# EAGLE design solenoid valve (EAGLE 9.2.2)

## Sheet 1 of 5: photorelay0
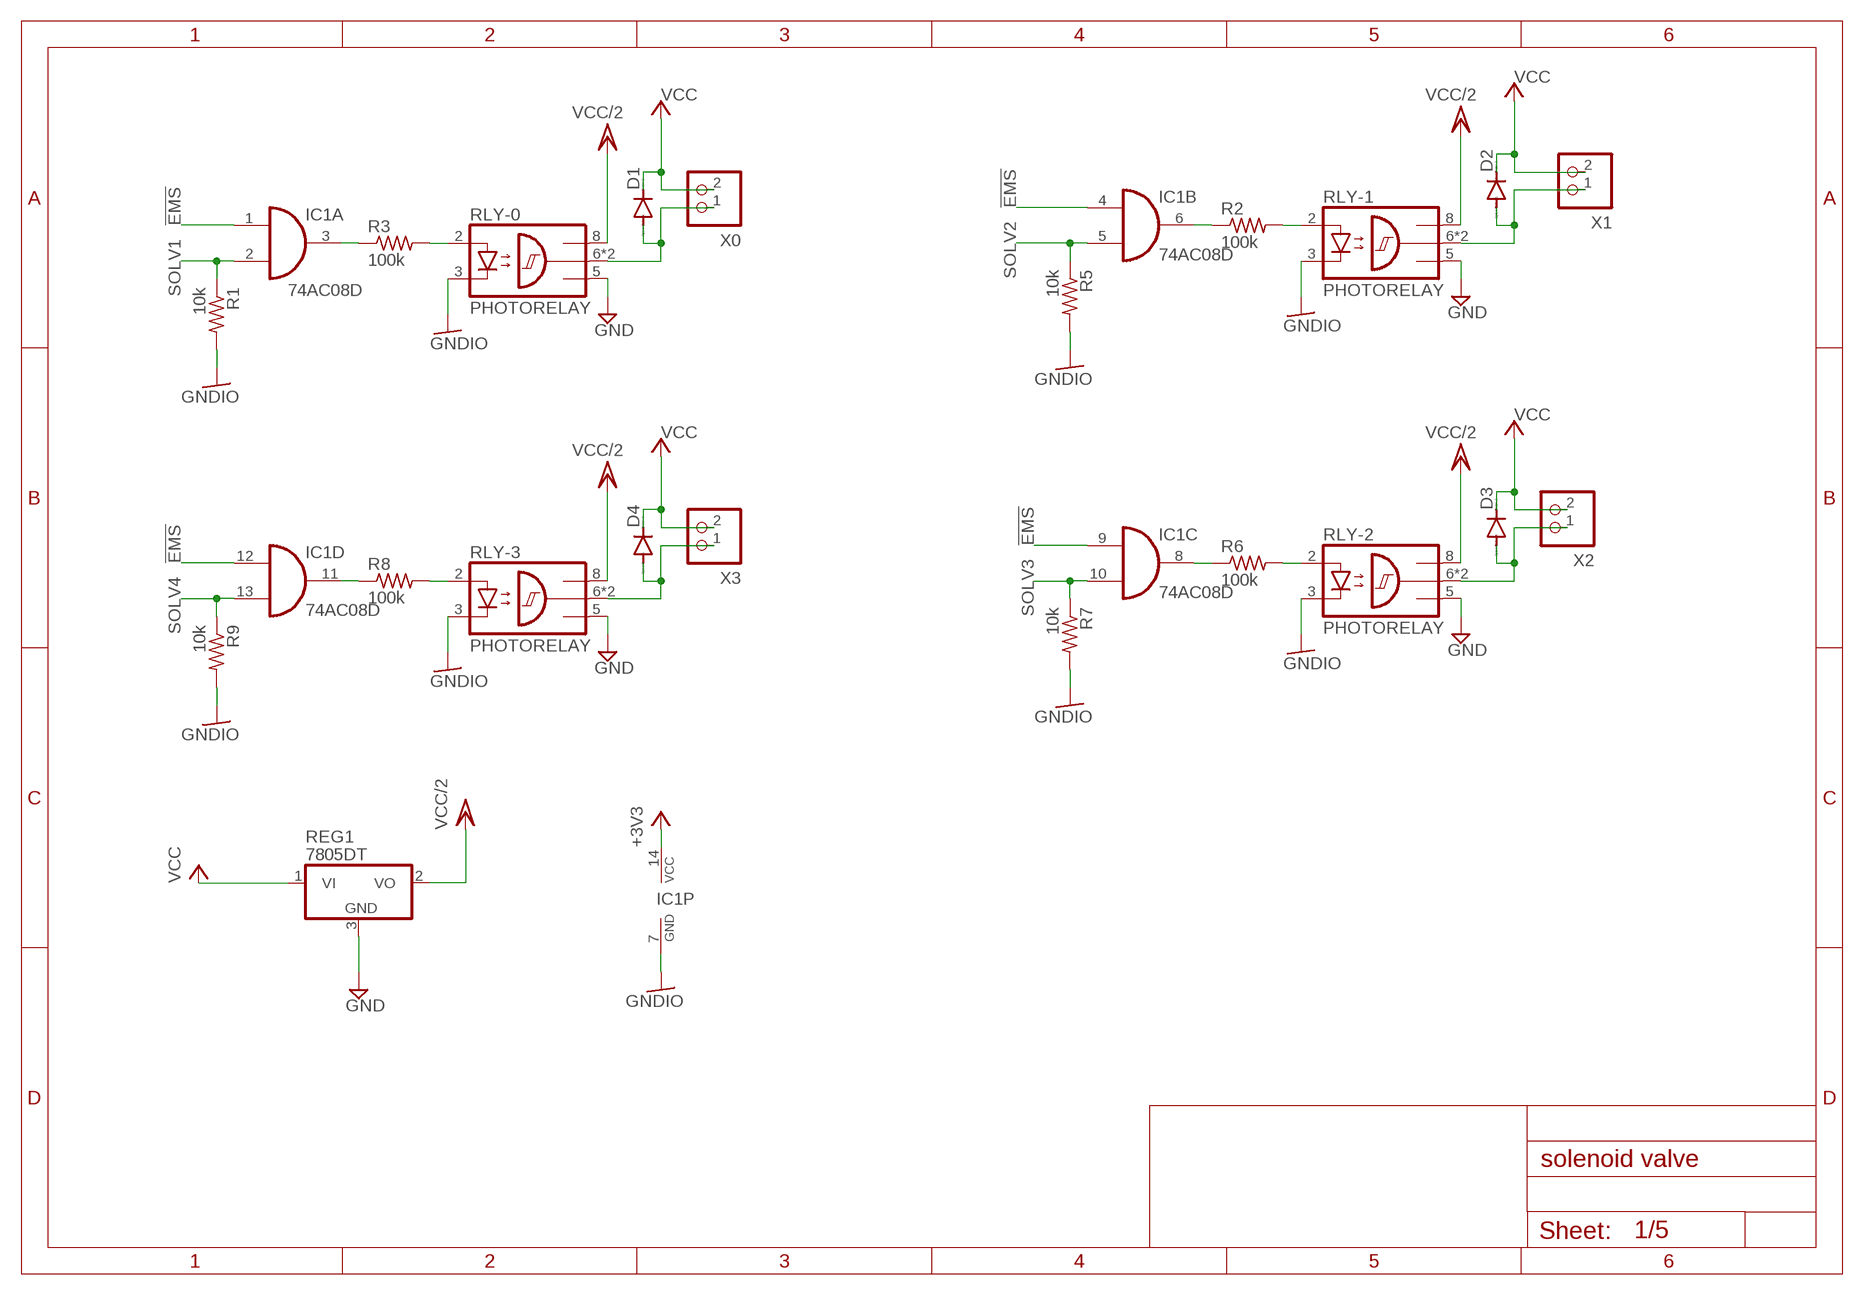
[diagram p0: schematic, sheet 1]

### Parts
D1  DIODE-SOD123  [SOD123]
D2  DIODE-SOD123  [SOD123]
D3  DIODE-SOD123  [SOD123]
D4  DIODE-SOD123  [SOD123]
IC1  74AC08D  [SO14]
R1  10k  R-US_R0603  [R0603]
R2  100k  R-US_R0603  [R0603]
R3  100k  R-US_R0603  [R0603]
R5  10k  R-US_R0603  [R0603]
R6  100k  R-US_R0603  [R0603]
R7  10k  R-US_R0603  [R0603]
R8  100k  R-US_R0603  [R0603]
R9  10k  R-US_R0603  [R0603]
REG1  7805DT  [TO252]
RLY-0  PHOTORELAY  [SOP254P1016X385-8]
RLY-1  PHOTORELAY  [SOP254P1016X385-8]
RLY-2  PHOTORELAY  [SOP254P1016X385-8]
RLY-3  PHOTORELAY  [SOP254P1016X385-8]
X0  S2B-XH-A  [S2B-XH-A]
X1  S2B-XH-A  [S2B-XH-A]
X2  S2B-XH-A  [S2B-XH-A]
X3  S2B-XH-A  [S2B-XH-A]

### Nets
!EMS: IC1.1(A:I0) IC1.4(B:I0) IC1.9(C:I0) IC1.12(D:I0) ; also sheet 2,3,4
+3V3: IC1.14(P:VCC) ; also sheet 2,3,5
GND: REG1.3(GND) RLY-0.5(GND) RLY-1.5(GND) RLY-2.5(GND) RLY-3.5(GND) ; also sheet 2
GNDIO: IC1.7(P:GND) R1.2 R5.2 R7.2 R9.2 RLY-0.3(C) RLY-1.3(C) RLY-2.3(C) RLY-3.3(C) ; also sheet 2,3,4,5
N$1: D2.A RLY-1.6(OUT) RLY-1.7(OUT) X1.1
N$2: R2.2 RLY-1.2(A)
N$3: D1.A RLY-0.6(OUT) RLY-0.7(OUT) X0.1
N$4: IC1.6(B:O) R2.1
N$5: D3.A RLY-2.6(OUT) RLY-2.7(OUT) X2.1
N$6: R3.2 RLY-0.2(A)
N$7: IC1.3(A:O) R3.1
N$8: R6.2 RLY-2.2(A)
N$20: IC1.8(C:O) R6.1
N$23: D4.A RLY-3.6(OUT) RLY-3.7(OUT) X3.1
N$24: R8.2 RLY-3.2(A)
N$25: IC1.11(D:O) R8.1
SOLV1: IC1.2(A:I1) R1.1 ; also sheet 3
SOLV2: IC1.5(B:I1) R5.1 ; also sheet 3
SOLV3: IC1.10(C:I1) R7.1 ; also sheet 3
SOLV4: IC1.13(D:I1) R9.1 ; also sheet 3
VCC: D1.C D2.C D3.C D4.C REG1.1(VI) X0.2 X1.2 X2.2 X3.2 ; also sheet 2
VCC/2: REG1.2(VO) RLY-0.8(VCC) RLY-1.8(VCC) RLY-2.8(VCC) RLY-3.8(VCC) ; also sheet 2

## Sheet 2 of 5: photorelay1
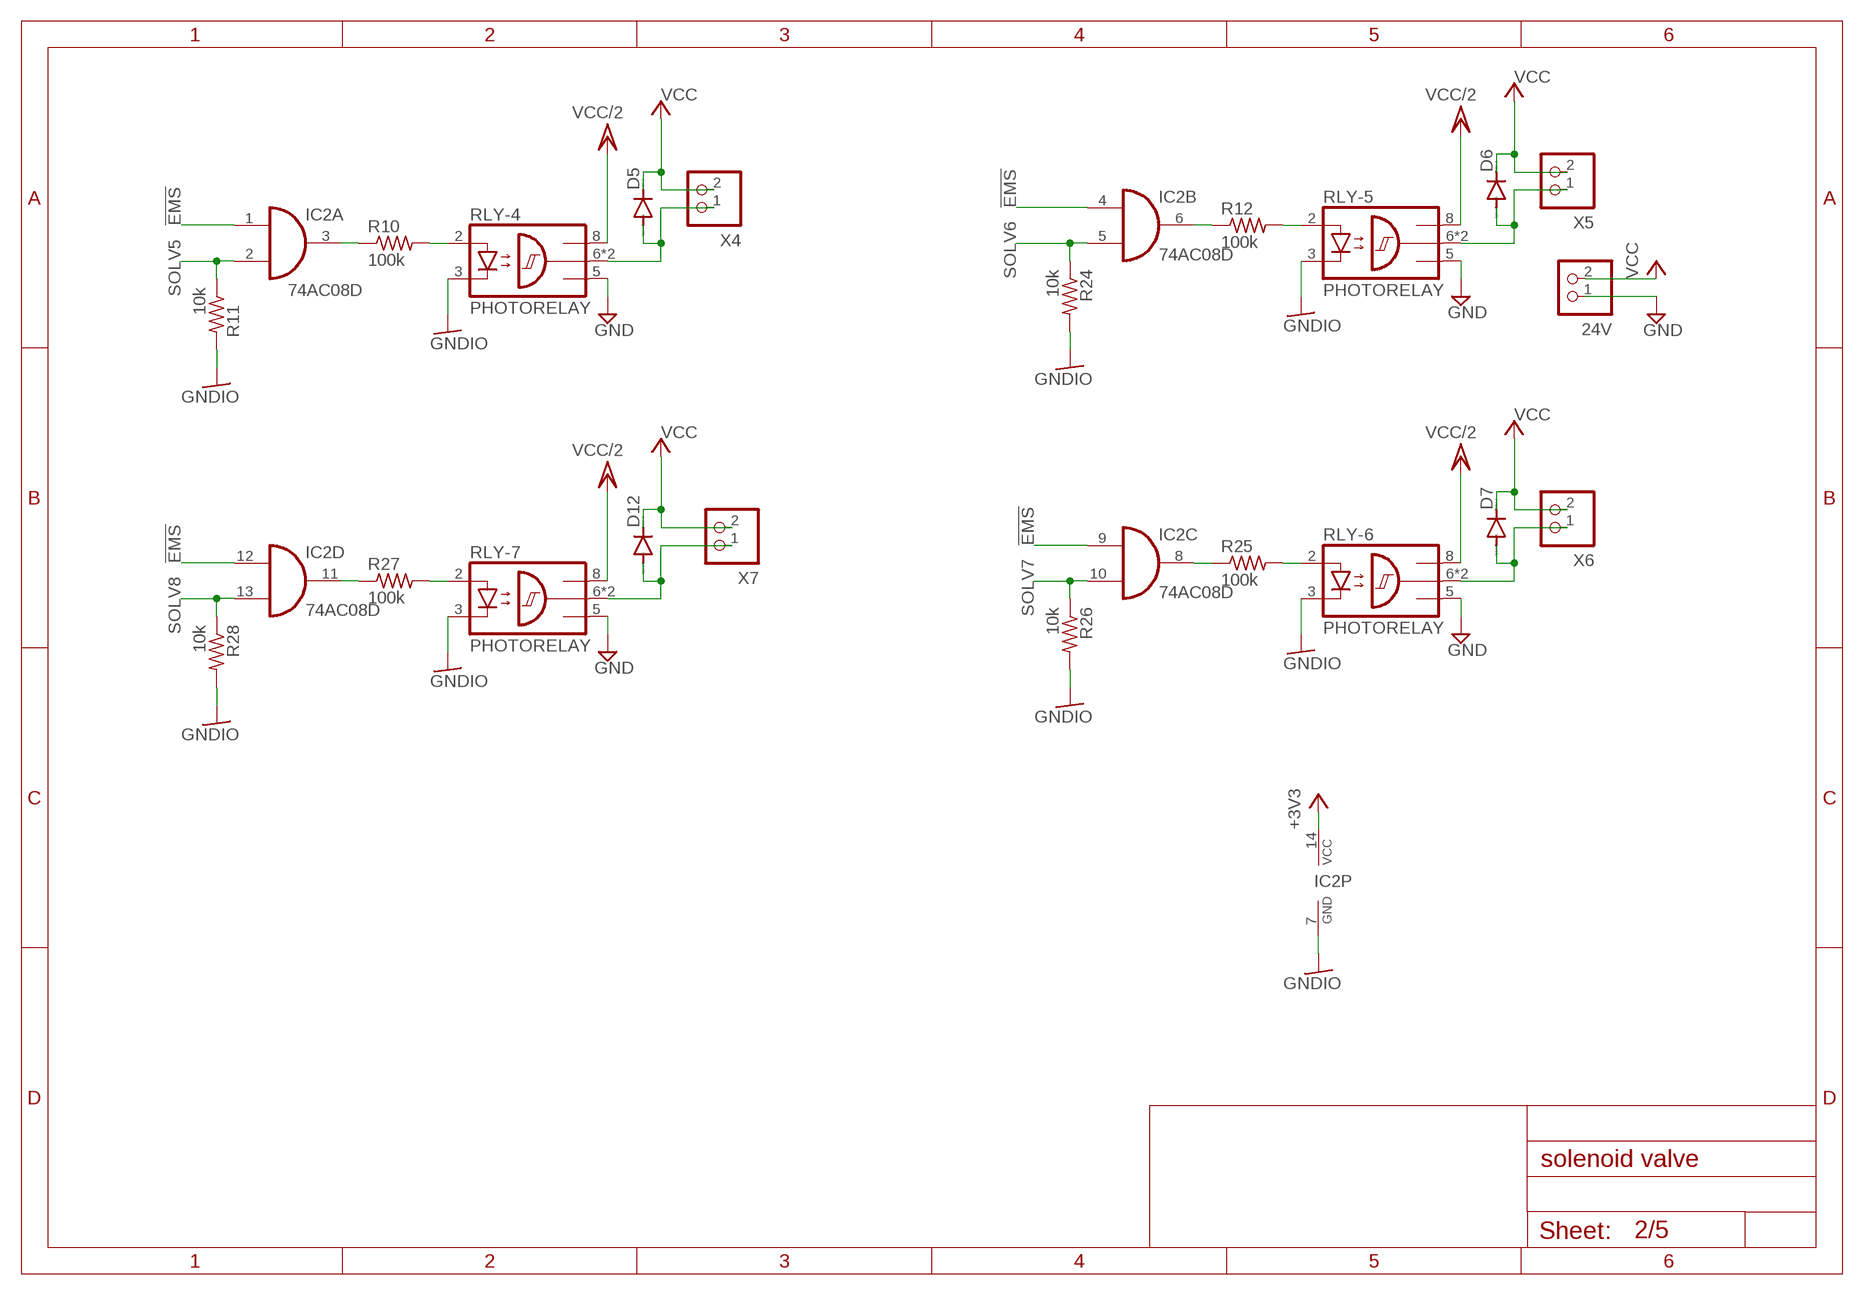
[diagram p1: schematic, sheet 2]

### Parts
24V  S2B-XH-A  [S2B-XH-A]
D5  DIODE-SOD123  [SOD123]
D6  DIODE-SOD123  [SOD123]
D7  DIODE-SOD123  [SOD123]
D12  DIODE-SOD123  [SOD123]
IC2  74AC08D  [SO14]
R10  100k  R-US_R0603  [R0603]
R11  10k  R-US_R0603  [R0603]
R12  100k  R-US_R0603  [R0603]
R24  10k  R-US_R0603  [R0603]
R25  100k  R-US_R0603  [R0603]
R26  10k  R-US_R0603  [R0603]
R27  100k  R-US_R0603  [R0603]
R28  10k  R-US_R0603  [R0603]
RLY-4  PHOTORELAY  [SOP254P1016X385-8]
RLY-5  PHOTORELAY  [SOP254P1016X385-8]
RLY-6  PHOTORELAY  [SOP254P1016X385-8]
RLY-7  PHOTORELAY  [SOP254P1016X385-8]
X4  S2B-XH-A  [S2B-XH-A]
X5  S2B-XH-A  [S2B-XH-A]
X6  S2B-XH-A  [S2B-XH-A]
X7  S2B-XH-A  [S2B-XH-A]

### Nets
!EMS: IC2.1(A:I0) IC2.4(B:I0) IC2.9(C:I0) IC2.12(D:I0) ; also sheet 1,3,4
+3V3: IC2.14(P:VCC) ; also sheet 1,3,5
GND: 24V.1 RLY-4.5(GND) RLY-5.5(GND) RLY-6.5(GND) RLY-7.5(GND) ; also sheet 1
GNDIO: IC2.7(P:GND) R11.2 R24.2 R26.2 R28.2 RLY-4.3(C) RLY-5.3(C) RLY-6.3(C) RLY-7.3(C) ; also sheet 1,3,4,5
N$26: D5.A RLY-4.6(OUT) RLY-4.7(OUT) X4.1
N$27: R10.2 RLY-4.2(A)
N$28: IC2.3(A:O) R10.1
N$29: D6.A RLY-5.6(OUT) RLY-5.7(OUT) X5.1
N$30: R12.2 RLY-5.2(A)
N$31: IC2.6(B:O) R12.1
N$32: D7.A RLY-6.6(OUT) RLY-6.7(OUT) X6.1
N$33: R25.2 RLY-6.2(A)
N$34: IC2.8(C:O) R25.1
N$35: D12.A RLY-7.6(OUT) RLY-7.7(OUT) X7.1
N$36: R27.2 RLY-7.2(A)
N$37: IC2.11(D:O) R27.1
SOLV5: IC2.2(A:I1) R11.1 ; also sheet 3
SOLV6: IC2.5(B:I1) R24.1 ; also sheet 3
SOLV7: IC2.10(C:I1) R26.1 ; also sheet 3
SOLV8: IC2.13(D:I1) R28.1 ; also sheet 3
VCC: 24V.2 D5.C D6.C D7.C D12.C X4.2 X5.2 X6.2 X7.2 ; also sheet 1
VCC/2: RLY-4.8(VCC) RLY-5.8(VCC) RLY-6.8(VCC) RLY-7.8(VCC) ; also sheet 1

## Sheet 3 of 5: mcu
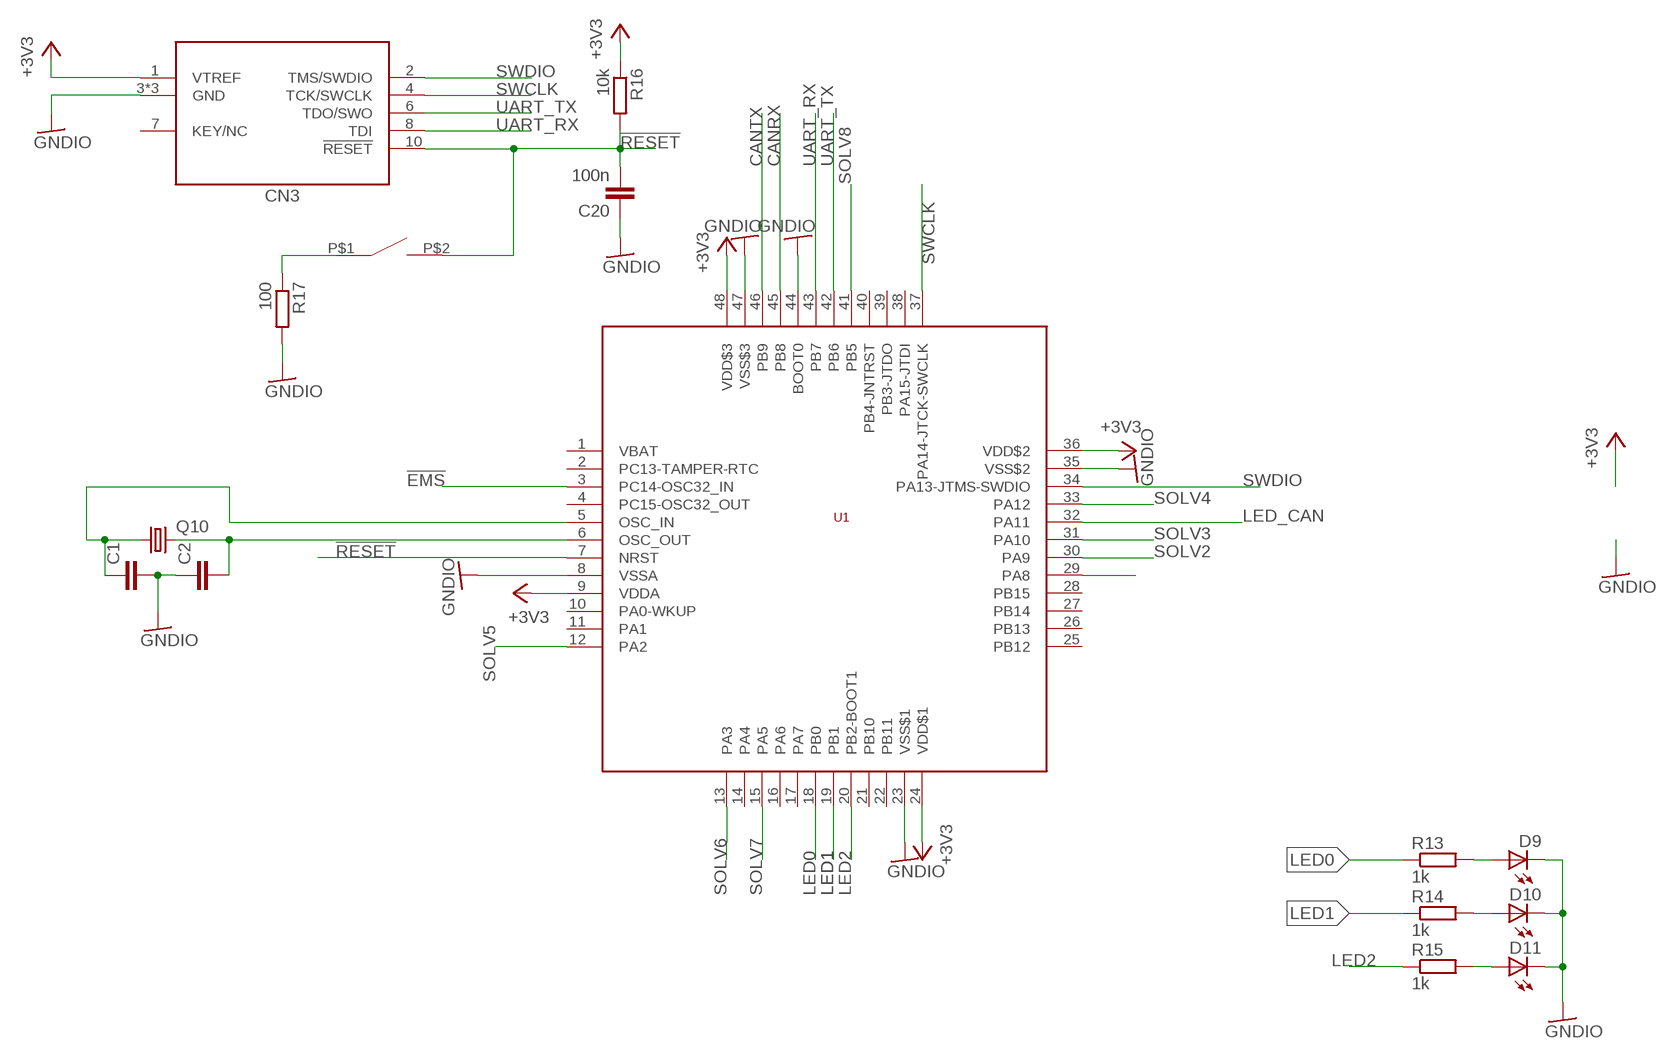
[diagram p2: schematic, sheet 3]

### Parts
C1  C-EUC0603  [C0603]
C2  C-EUC0603  [C0603]
C20  100n  C-EUC0603  [C0603]
CN3  CON_SWD_1.27_SMD  [CON_SWD_1.27_SMD]
D9  LEDCHIPLED_0805  [CHIPLED_0805]
D10  LEDCHIPLED_0805  [CHIPLED_0805]
D11  LEDCHIPLED_0805  [CHIPLED_0805]
Q10  CRYSTALHC49UP  [HC49UP]
R13  1k  R-EU_R0603  [R0603]
R14  1k  R-EU_R0603  [R0603]
R15  1k  R-EU_R0603  [R0603]
R16  10k  R-EU_R0603  [R0603]
R17  100  R-EU_R0603  [R0603]
SW1  SWITCH_TACTILETOP  [SWITCH_TACTILE_3X6]
U1  STM32F103C8  [LQFP48]

### Nets
!EMS: U1.3(PC14-OSC32_IN) ; also sheet 1,2,4
!RESET: C20.2 CN3.10(!RESET) R16.2 SW1.P$2 U1.7(NRST)
+3V3: CN3.1(VTREF) R16.1 U1.9(VDDA) U1.24(VDD$1) U1.36(VDD$2) U1.48(VDD$3) ; also sheet 1,2,5
CANRX: U1.45(PB8) ; also sheet 4
CANTX: U1.46(PB9) ; also sheet 4
GNDIO: C1.2 C2.1 C20.1 CN3.3(GND) CN3.5(GND) CN3.9(GND) D9.C D10.C D11.C R17.2 U1.8(VSSA) U1.23(VSS$1) U1.35(VSS$2) U1.44(BOOT0) U1.47(VSS$3) ; also sheet 1,2,4,5
LED0: R13.1 U1.18(PB0)
LED1: R14.1 U1.19(PB1)
LED2: R15.1 U1.20(PB2-BOOT1)
LED_CAN: U1.32(PA11) ; also sheet 4
N$9: D10.A R14.2
N$10: D9.A R13.2
N$11: C2.2 Q10.2 U1.6(OSC_OUT)
N$16: R17.1 SW1.P$1
N$19: C1.1 Q10.1 U1.5(OSC_IN)
N$21: D11.A R15.2
SOLV1: U1.29(PA8) ; also sheet 1
SOLV2: U1.30(PA9) ; also sheet 1
SOLV3: U1.31(PA10) ; also sheet 1
SOLV4: U1.33(PA12) ; also sheet 1
SOLV5: U1.12(PA2) ; also sheet 2
SOLV6: U1.13(PA3) ; also sheet 2
SOLV7: U1.15(PA5) ; also sheet 2
SOLV8: U1.41(PB5) ; also sheet 2
SWCLK: CN3.4(TCK/SWCLK) U1.37(PA14-JTCK-SWCLK)
SWDIO: CN3.2(TMS/SWDIO) U1.34(PA13-JTMS-SWDIO)
UART_RX: CN3.8(TDI) U1.43(PB7)
UART_TX: CN3.6(TDO/SWO) U1.42(PB6)
Unconnected: CN3.7(KEY/NC) U1.1(VBAT) U1.2(PC13-TAMPER-RTC) U1.4(PC15-OSC32_OUT) U1.10(PA0-WKUP) U1.11(PA1) U1.14(PA4) U1.16(PA6) U1.17(PA7) U1.21(PB10) U1.22(PB11) U1.25(PB12) U1.26(PB13) U1.27(PB14) U1.28(PB15) U1.38(PA15-JTDI) U1.39(PB3-JTDO) U1.40(PB4-JNTRST)

## Sheet 4 of 5: can
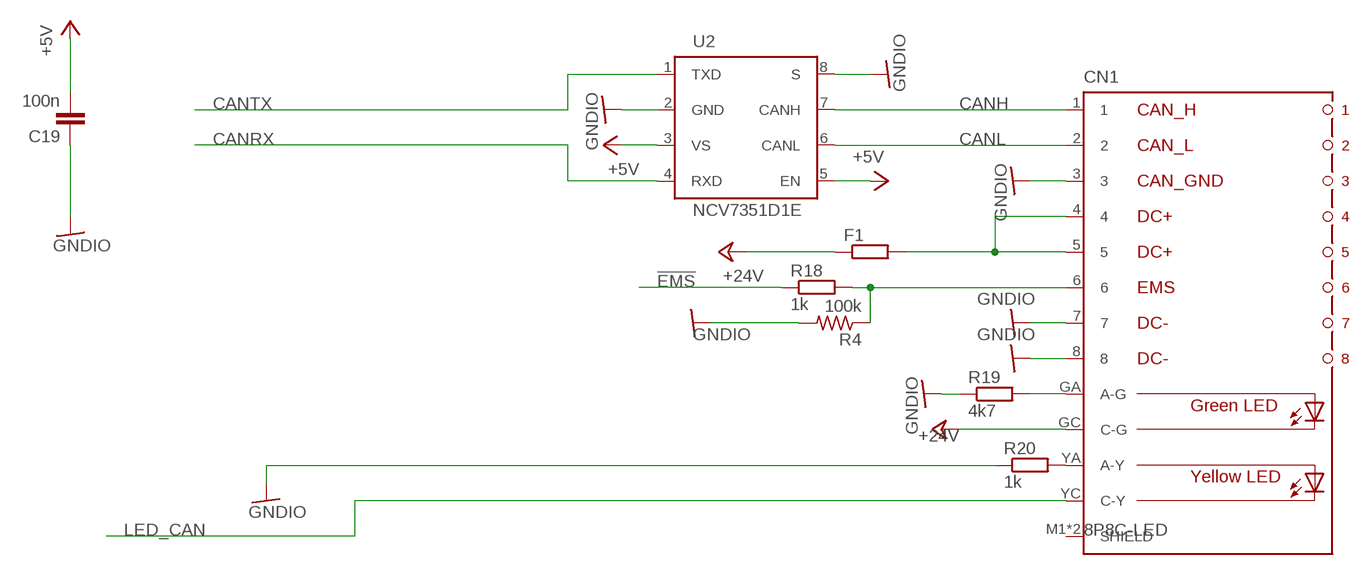
[diagram p3: schematic, sheet 4]

### Parts
C19  100n  C-EUC0603  [C0603]
CN1  8P8C-LED  [8P8C-LED]
F1  R-EU_R1206  [R1206]
R4  100k  R-US_R0603  [R0603]
R18  1k  R-EU_R0603  [R0603]
R19  4k7  R-EU_R0603  [R0603]
R20  1k  R-EU_R0603  [R0603]
U2  NCV7351D1E  [SO08]

### Nets
!EMS: R18.1 ; also sheet 1,2,3
+5V: C19.2 U2.3(VS) U2.5(EN) ; also sheet 5
+24V: CN1.GC(C-G) F1.1 ; also sheet 5
CANH: CN1.1 U2.7(CANH)
CANL: CN1.2 U2.6(CANL)
CANRX: U2.4(RXD) ; also sheet 3
CANTX: U2.1(TXD) ; also sheet 3
GNDIO: C19.1 CN1.3 CN1.7 CN1.8 R4.2 R19.1 R20.1 U2.2(GND) U2.8(S) ; also sheet 1,2,3,5
LED_CAN: CN1.YC(C-Y) ; also sheet 3
N$12: CN1.4 CN1.5 F1.2
N$18: CN1.YA(A-Y) R20.2
N$22: CN1.GA(A-G) R19.2
N$38: CN1.6 R4.1 R18.2
Unconnected: CN1.M1(SHIELD) CN1.M2(SHIELD)

## Sheet 5 of 5: power suply
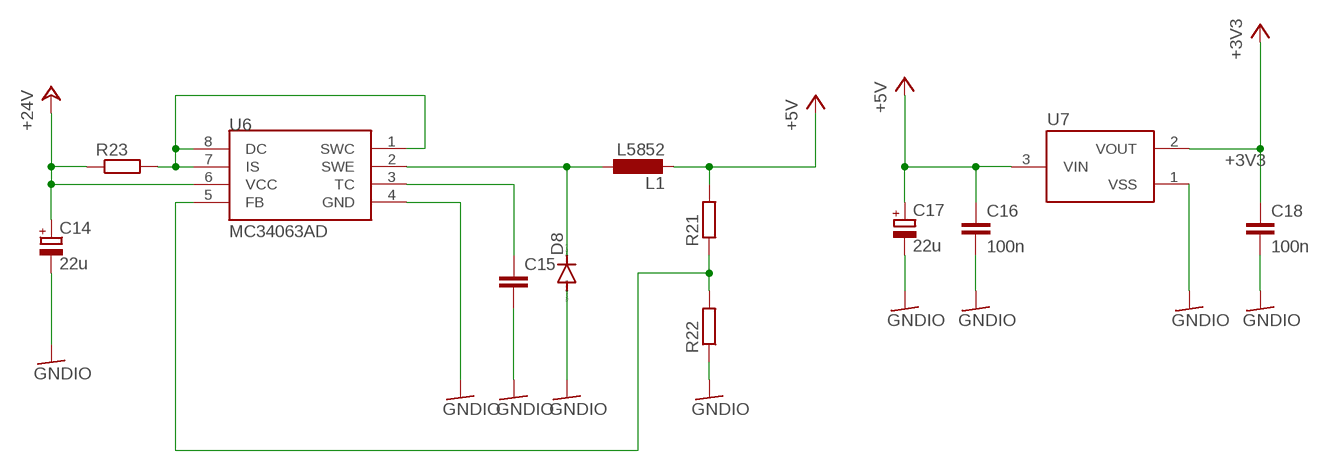
[diagram p4: schematic, sheet 5]

### Parts
C14  22u  CPOL-EUE2-5  [E2-5]
C15  C-EUC0603  [C0603]
C16  100n  C-EUC0603  [C0603]
C17  22u  CPOL-EUE2-5  [E2-5]
C18  100n  C-EUC0603  [C0603]
D8  DIODE-SOD123  [SOD123]
L1  L5852  [L5852]
R21  R-EU_R0603  [R0603]
R22  R-EU_R0603  [R0603]
R23  R-EU_R1206  [R1206]
U6  MC34063AD  [SOIC8]
U7  XC6206  [SOT95P240X110-3]

### Nets
+3V3: C18.1 U7.2(VOUT) ; also sheet 1,2,3
+5V: C16.1 C17.+ L1.P$2 R21.2 U7.3(VIN) ; also sheet 4
+24V: C14.+ R23.1 U6.6(VCC) ; also sheet 4
GNDIO: C14.- C15.2 C16.2 C17.- C18.2 D8.A R22.1 U6.4(GND) U7.1(VSS) ; also sheet 1,2,3,4
N$13: R23.2 U6.1(SWC) U6.7(IS) U6.8(DC)
N$14: D8.C L1.P$1 U6.2(SWE)
N$15: C15.1 U6.3(TC)
N$17: R21.1 R22.2 U6.5(FB)

## Library data of the parts
24V X0 X1-X7 = jst-xh:S2B-XH-A: Wire-to-Board 2.5mm pitch side mount connector Source: http://www.jst-mfg.com/product/pdf/jpn/XH.pdf http://www.jst-mfg.com/product/detail.php?series=277
C1 C2 C15 = rcl:C-EU: CAPACITOR, European symbol; SPICEPREFIX: C
C14 C17 = rcl:CPOL-EU: POLARIZED CAPACITOR, European symbol
C16 C18-C20 = rcl:C-EU: CAPACITOR, European symbol
CN1 = con-rj45:8P8C-LED: generic 8P8C connector with two LED's; OC_FARNELL: unknown; OC_NEWARK: unknown
CN3 = con-swd:CON_SWD_1.27_SMD
D1-D8 D12 = diode:DIODE-: DIODE
D9-D11 = led:LED: LED OSRAM: - CHIPLED LG R971, LG N971, LY N971, LG Q971, LY Q971, LO R971, LY R971 LH N974, LH R974 LS Q976, LO Q976, LY Q976 LO Q996 - Hyper CHIPLED LW Q18S LB Q993, LB Q99A, LB R99A - SideLED LS A670, LO A670, LY A670, LG A670, LP A670 LB A673, LV A673, LT A673, LW A673 LH A674 LY A675 LS A676, LA A676, LO A676, LY A676, LW A676 LS A679, LY A679, LG A679 - Hyper Micro SIDELED® LS Y876, LA Y876, LO Y876, LY Y876 LT Y87S - SmartLED LW L88C, LW L88S LB L89C, LB L89S, LG L890 LS L89K, LO L89K, LY L89K LS L896, LA L896, LO L896, LY L896 - TOPLED LS T670, LO T670, LY T670, LG T670, LP T670 LSG T670, LSP T670, LSY T670, LOP T670, LYG T670 LG T671, LOG T671, LSG T671 LB T673, LV T673, LT T673, LW T673 LH T674 LS T676, LA T676, LO T676, LY T676, LB T676, LH T676, LSB T676, LW T676 LB T67C, LV T67C, LT T67C, LS T67K, LO T67K, LY T67K, LW E67C LS E67B, LA E67B, LO E67B, LY E67B, LB E67C, LV E67C, LT E67C LW T67C LS T679, LY T679, LG T679 LS T770, LO T770, LY T770, LG T770, LP T770 LB T773, LV T773, LT T773, LW T773 LH T774 LS E675, LA E675, LY E675, LS T675 LS T776, LA T776, LO T776, LY T776, LB T776 LHGB T686 LT T68C, LB T68C - Hyper Mini TOPLED® LB M676 - Mini TOPLED Santana® LG M470 LS M47K, LO M47K, LY M47K Source: http://www.osram.convergy.de LUXEON: - LUMILED® LXK2-PW12-R00, LXK2-PW12-S00, LXK2-PW14-U00, LXK2-PW14-V00 LXK2-PM12-R00, LXK2-PM12-S00, LXK2-PM14-U00 LXK2-PE12-Q00, LXK2-PE12-R00, LXK2-PE12-S00, LXK2-PE14-T00, LXK2-PE14-U00 LXK2-PB12-K00, LXK2-PB12-L00, LXK2-PB12-M00, LXK2-PB14-N00, LXK2-PB14-P00, LXK2-PB14-Q00 LXK2-PR12-L00, LXK2-PR12-M00, LXK2-PR14-Q00, LXK2-PR14-R00 LXK2-PD12-Q00, LXK2-PD12-R00, LXK2-PD12-S00 LXK2-PH12-R00, LXK2-PH12-S00 LXK2-PL12-P00, LXK2-PL12-Q00, LXK2-PL12-R00 Source: www.luxeon.com KINGBRIGHT: KA-3528ASYC Source: www.kingbright.com
F1 R18-R23 = rcl:R-EU_: RESISTOR, European symbol; SPICEPREFIX: R
IC1 IC2 = 74xx-eu:74*08: Quad 2-input AND gate
L1 = l_ysk:L5852
Q10 = crystal:CRYSTAL: CRYSTAL; OC_FARNELL: unknown; OC_NEWARK: unknown
R1-R12 R24-R28 = rcl:R-US_: RESISTOR, American symbol; SPICEPREFIX: R
R13-R17 = rcl:R-EU_: RESISTOR, European symbol
REG1 = linear:78*: Positive VOLTAGE REGULATOR Source: http://cache.national.com/ds/LM/LM78L05.pdf http://www.fairchildsemi.com/ds/LM/LM7805.pdf
RLY-0 RLY-1-RLY-7 = opto-coupler:PHOTORELAY
SW1 = switch-tactile:SWITCH_TACTILE
U1 = stm32_mcu:STM32F103C8: STMicroelectronics STM32F103C8 Mainstream Performance line, ARM Cortex-M3 MCU with 64 Kbytes Flash, 72 MHz CPU, motor control, USB and CAN references: datasheet <https://www.st.com/resource/en/datasheet/stm32f103c8.pdf> product page <https://www.st.com/ja/microcontrollers/stm32f103c8.html>
U2 = on-semi:NCV7351D1E: High Speed CAN Transceiver Source: NCV7351-D.PDF <http://www.onsemi.com/PowerSolutions/document/NCV7351-D.PDF>
U6 = mc34063:MC34063
U7 = torex:XC6206

## Board
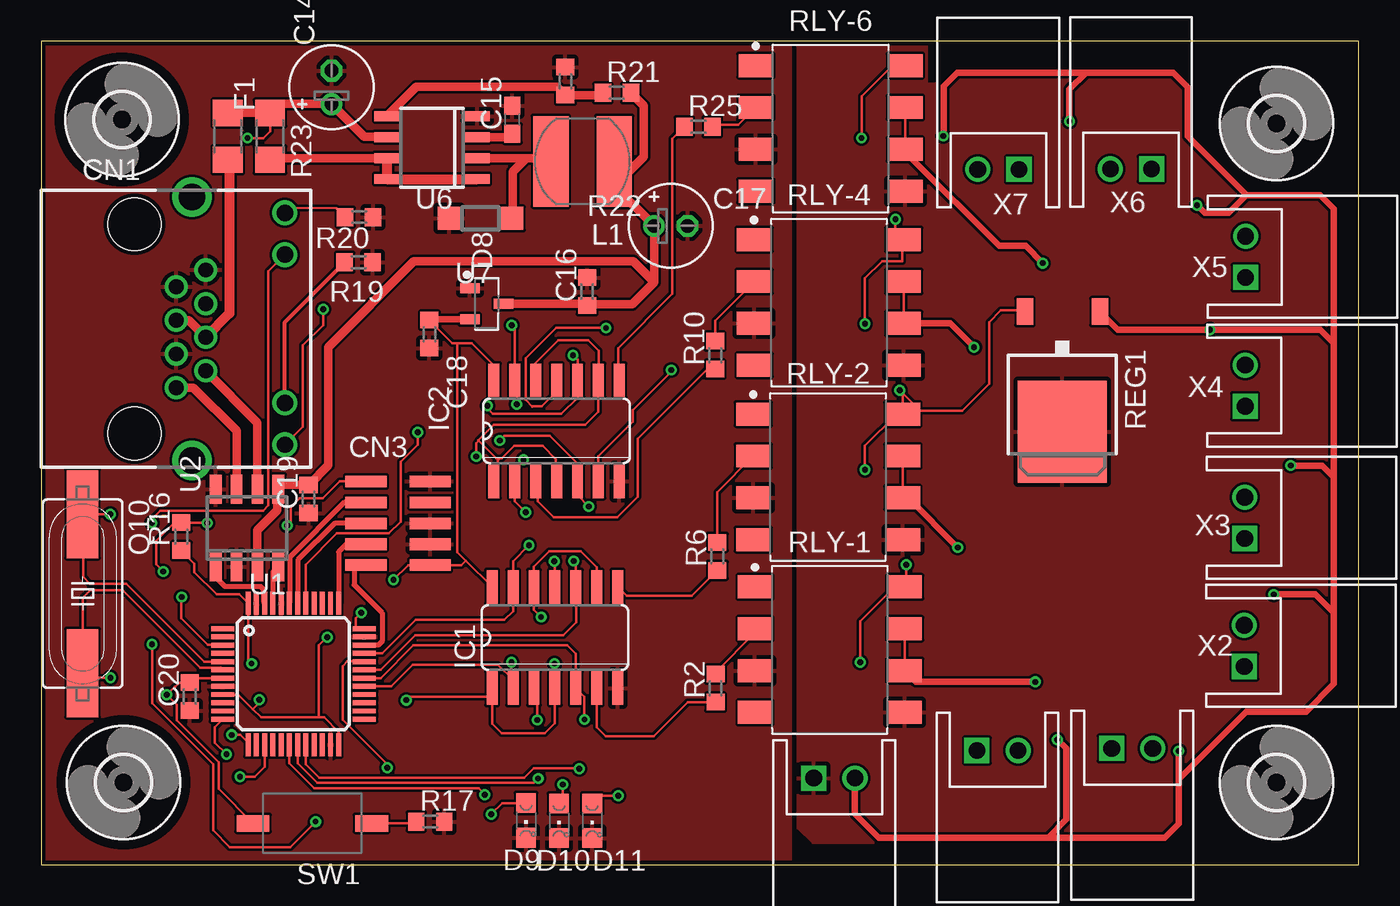
[diagram p5: board, top side]
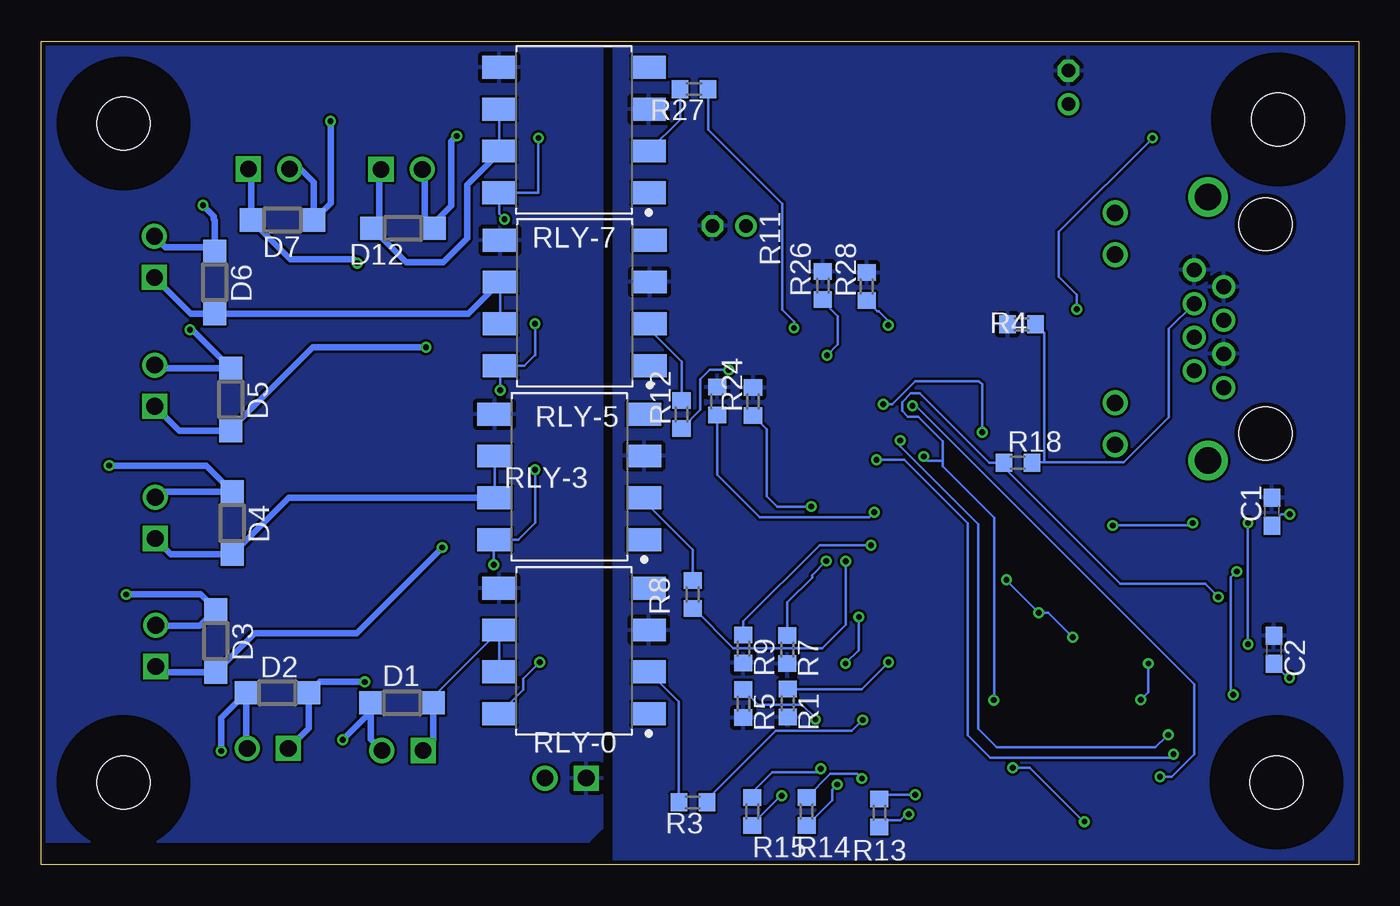
[diagram p6: board, bottom side, seen from below]

Size 80 x 50 mm. Coordinates in mm from the lower left corner, seen from the top.
Outline: 0,0 80,0 80,50 0,50 0,0
Copper layers (1*16): Top 0.035mm / dielectric 1.5mm / Bottom 0.035mm
Design rules "SeeedStudio_2layer_DRU_no_angle_20140221": minimum track width 6mil, minimum drill 12mil, track to track 6mil, track to pad 6mil, pad to pad 6mil, via to via 6mil, smd to smd 0mil, copper to edge 10mil, drill to drill 10mil, minimum pad ring 10mil, minimum via ring 6mil, stop-mask expansion 2mil, vias tented up to drill 100mil, thermal gap 10mil

### Footprints (pad centres in the part's own frame; a part is rotated, then mirrored left to right if it is on the bottom)
S2B-XH-A = drill 1.016 square: 1 1.25,0 | drill 1.016: 2 -1.25,0
C0603 = smd 1.1 x 1: 1 -0.85,0; 2 0.85,0
E2-5 = drill 0.813 pad 1.27: + -1.016,0 | drill 0.813 pad 1.27 octagon: - 1.016,0
C0603' = smd 1 x 1.1: 1 -0.85,0; 2 0.85,0
8P8C-LED = drill 0.9 pad 1.3: 1 3.57,-3.81; 2 2.55,-2.03; 3 1.53,-3.81; 4 0.51,-2.03; 5 -0.51,-3.81; 6 -1.53,-2.03; 7 -2.55,-3.81; 8 -3.57,-2.03 | drill 1 pad 1.422: GA 4.5,2.78; GC 7.04,2.78; YA -7.04,2.78; YC -4.5,2.78 | drill 1.6 pad 2.184: M1 -8,-2.85; M2 8,-2.85 | hole 3.2: 6.35,-6.35; -6.35,-6.35
CON_SWD_1.27_SMD = smd 0.7 x 2.5: 1 2.54,1.95; 2 2.54,-1.95; 3 1.27,1.95; 4 1.27,-1.95; 5 0,1.95; 6 0,-1.95; 7 -1.27,1.95; 8 -1.27,-1.95; 9 -2.54,1.95; 10 -2.54,-1.95
SOD123 = smd 1.4 x 1.4: A 1.9,0; C -1.9,0
CHIPLED_0805 = smd 1.2 x 1.2: A 0,-1.05; C 0,1.05
R1206 = smd 1.6 x 1.803: 1 -1.422,0; 2 1.422,0
SO14 = smd 0.66 x 2.032: 1 -3.81,-3.073; 2 -2.54,-3.073; 3 -1.27,-3.073; 4 0,-3.073; 5 1.27,-3.073; 6 2.54,-3.073; 7 3.81,-3.073; 8 3.81,3.073; 9 2.54,3.073; 10 1.27,3.073; 11 0,3.073; 12 -1.27,3.073; 13 -2.54,3.073; 14 -3.81,3.073
L5852 = smd 2.15 x 5.5: P$1 1.925,0; P$2 -1.925,0
HC49UP = smd 5.334 x 1.93: 1 -4.826,0; 2 4.826,0
R0603 = smd 1 x 1.1: 1 -0.85,0; 2 0.85,0
TO252 = smd 1 x 1.6: 1 -2.28,-4.8; 2 2.28,-4.8 | smd 5.4 x 6.2: 3 0,2.5
SOP254P1016X385-8 = smd 2.09 x 1.389: 1 -4.54,3.81; 2 -4.54,1.27; 3 -4.54,-1.27; 4 -4.54,-3.81; 5 4.54,-3.81; 6 4.54,-1.27; 7 4.54,1.27; 8 4.54,3.81
SWITCH_TACTILE_3X6 = smd 2 x 1: P$1 -3.6,0; P$2 3.6,0
LQFP48 = smd 1.4 x 0.3: 1 -4.3,2.75; 2 -4.3,2.25; 3 -4.3,1.75; 4 -4.3,1.25; 5 -4.3,0.75; 6 -4.3,0.25; 7 -4.3,-0.25; 8 -4.3,-0.75; 9 -4.3,-1.25; 10 -4.3,-1.75; 11 -4.3,-2.25; 12 -4.3,-2.75; 25 4.3,-2.75; 26 4.3,-2.25; 27 4.3,-1.75; 28 4.3,-1.25; 29 4.3,-0.75; 30 4.3,-0.25; 31 4.3,0.25; 32 4.3,0.75; 33 4.3,1.25; 34 4.3,1.75; 35 4.3,2.25; 36 4.3,2.75 | smd 0.3 x 1.4: 13 -2.75,-4.3; 14 -2.25,-4.3; 15 -1.75,-4.3; 16 -1.25,-4.3; 17 -0.75,-4.3; 18 -0.25,-4.3; 19 0.25,-4.3; 20 0.75,-4.3; 21 1.25,-4.3; 22 1.75,-4.3; 23 2.25,-4.3; 24 2.75,-4.3; 37 2.75,4.3; 38 2.25,4.3; 39 1.75,4.3; 40 1.25,4.3; 41 0.75,4.3; 42 0.25,4.3; 43 -0.25,4.3; 44 -0.75,4.3; 45 -1.25,4.3; 46 -1.75,4.3; 47 -2.25,4.3; 48 -2.75,4.3
SO08 = smd 0.72 x 1.78: 1 -1.905,-2.35; 2 -0.635,-2.35; 3 0.635,-2.35; 4 1.905,-2.35; 5 1.905,2.35; 6 0.635,2.35; 7 -0.635,2.35; 8 -1.905,2.35
SOIC8 = smd 0.6 x 1.5: 1 -1.905,-2.75; 2 -0.635,-2.75; 3 0.635,-2.75; 4 1.905,-2.75; 5 1.905,2.75; 6 0.635,2.75; 7 -0.635,2.75; 8 -1.905,2.75
SOT95P240X110-3 = smd 1.18 x 0.609: 1 -1.024,0.95; 2 -1.024,-0.95; 3 1.024,0
3,2 = hole 3.2: 0,0

### Placement (x,y rotation side)
24V  48.16,5.26 180 top
C1  5.28,21.44 90 bottom
C2  5.16,13.06 270 bottom
C14  17.63,47.19 90 top
C15  28.6,45.24 90 top
C16  100n  [C0603']  33.15,34.8 90 top
C17  38.23,38.79 0 top
C18  100n  [C0603']  23.57,32.21 270 top
C19  100n  [C0603']  16.23,22.2 90 top
C20  100n  [C0603']  9.02,10.21 90 top
CN1  12.01,32.54 270 top
CN3  21.67,20.73 270 top
D1  58.09,9.83 0 bottom
D2  65.66,10.44 0 bottom
D3  69.39,13.59 270 bottom
D4  68.4,20.75 270 bottom
D5  68.48,28.24 270 bottom
D6  69.47,35.36 270 bottom
D7  65.35,39.14 180 bottom
D8  26.67,39.24 180 top
D9  29.44,2.69 180 top
D10  31.45,2.67 180 top
D11  33.45,2.67 180 top
D12  58.04,38.63 180 bottom
F1  11.33,44.22 270 top
IC1  31.19,13.79 0 top
IC2  31.29,26.34 0 top
L1  32.87,42.7 180 top
Q10  2.51,16.46 270 top
R1  34.67,9.8 270 bottom
R2  40.94,10.72 90 top
R3  40.44,3.78 180 bottom
R4  20.47,32.82 180 bottom
R5  37.36,9.78 270 bottom
R6  41.05,18.72 90 top
R7  34.7,13.06 270 bottom
R8  40.44,16.41 90 bottom
R9  37.36,13.11 270 bottom
R10  40.92,30.94 90 top
R11  38.96,28.14 90 bottom
R12  41.12,27.33 90 bottom
R13  29.11,3.15 270 bottom
R14  33.53,3.23 270 bottom
R15  36.83,3.23 270 bottom
R16  8.51,19.91 90 top
R17  23.62,2.62 0 top
R18  20.7,24.41 0 bottom
R19  19.28,36.58 180 top
R20  19.3,39.32 180 top
R21  34.95,46.86 0 top
R22  31.83,47.57 270 top
R23  13.89,44.22 270 top
R24  36.78,28.12 90 bottom
R25  39.9,44.81 0 top
R26  32.54,35.15 90 bottom
R27  40.36,47.09 180 bottom
R28  29.87,35.1 90 bottom
REG1  62,28.78 180 top
RLY-0  47.65,12.98 180 bottom
RLY-1  47.88,13.06 0 top
RLY-2  47.78,23.55 0 top
RLY-3  47.93,23.55 180 bottom
RLY-4  47.83,34.14 0 top
RLY-5  47.6,34.11 180 bottom
RLY-6  47.93,44.7 0 top
RLY-7  47.65,44.6 180 bottom
SW1  16.46,2.51 180 top
U1  15.32,11.58 0 top
U2  12.5,20.45 0 top
U6  23.72,43.54 90 top
U7  27.05,34.06 0 top
U$1  [3,2]  5,5 0 top
U$2  [3,2]  4.9,45.24 0 top
U$3  [3,2]  75,45 0 top
U$4  [3,2]  75,5 0 top
X0  58.06,6.93 180 top
X1  66.24,7.06 180 top
X2  73.05,13.28 270 top
X3  73.08,21.06 270 top
X4  73.1,29.08 270 top
X5  73.13,36.91 270 top
X6  66.17,42.24 0 top
X7  58.12,42.21 0 top

### Tracks (layer width: path | path; a pad name or v marks a point on that pad's centre or on a via)
!EMS  (via drill 0.35)
  Top 0.152: U1.3 10.99,13.36 10.1,13.36 8.51,14.95 8.51,16.23 v8.53,16.26 | IC2.4 31.24,23.32 31.24,24.63 30.45,25.42 28.73,25.42 27.98,24.68 27.88,24.68 | IC2.1 27.72,23.5 27.72,24.52 27.88,24.68 | v31.17,12.22 31.17,11.66 31.19,11.64 IC1.4 31.19,8.59 30.58,7.98 27.97,7.98 27.38,8.56 IC1.1 27.38,10.54 27.03,10.2 22.36,10.2 v22.16,9.99 | v30.35,15.04 29.92,15.47 IC1.12 29.92,18.09 30.86,19.02 32.75,19.02 33.73,18.05 IC1.9 | IC2.12 29.91,29.53 29.91,30.36 31.39,31.84 33.2,31.84 33.85,31.2 33.85,29.43 IC2.9 33.83,27.52 33.04,26.72 27.48,26.72 26.53,25.77 26.57,25.73 | 26.57,25.73 26.42,25.58 v26.42,24.79 | 27.88,24.68 27.62,24.68 26.57,25.73
  Bottom 0.152: v22.16,9.99 22.13,10.02 22.13,21.07 25.25,24.18 25.25,24.54 | 25.25,24.54 25.25,25.7 26.75,27.21 27.38,27.21 27.73,27.56 27.73,28.09 27.2,28.63 26.66,28.63 22.44,24.41 R18.1 21.55,24.12 14.48,17.04 9.32,17.04 v8.53,16.26 | 25.25,24.54 26.16,24.54 v26.42,24.79 | v31.17,12.22 30.35,13.04 v30.35,15.04
!RESET  (via drill 0.35)
  Top 0.152: v14.94,20.6 15.14,20.6 15.14,21.68 15.7,22.25 17.1,22.25 18.12,23.27 CN3.10 | U1.7 9.29,11.33 C20.2 8.41,11.06 8.14,10.79 8.1,10.79 v7.62,10.31 8.23,9.7 8.23,8.77 10.77,6.23 10.77,4.6 SW1.P$2 | v7.42,17.8 6.99,18.24 6.99,19.67 8.08,20.76 R16.2 8.52,20.75 v10.08,20.75
  Bottom 0.152: v7.42,17.8 7.77,17.45 7.77,10.46 v7.62,10.31 | v14.94,20.6 10.24,20.6 v10.08,20.75
+3V3  (via drill 0.35)
  Top 0.152: 16.84,8.94 13.35,8.94 12.85,9.45 | 16.84,8.94 17.18,8.94 18.07,8.05 U1.24 | U1.36 19.11,14.33 19.11,14.97 v19.43,15.29 | 12.85,9.45 11.96,10.33 U1.9 | 16.84,8.94 16.84,13.31 17.35,13.82 v17.37,13.82 | C18.1 24.97,31.66 25.27,31.66 | 25.27,31.66 26.15,31.66 27.48,30.33 IC2.14 | 25.79,18.46 IC1.14 | 25.79,18.46 25.51,18.19 CN3.1 22.28,18.19 v21.39,17.3 | 25.79,18.46 25.27,18.97 25.27,31.66 | R16.1 9.3,18.28 9.3,17.77 10.65,16.42 12.03,16.42 U1.48 12.57,12.43 v12.78,12.22 | v13.23,10.01 13.23,9.83 12.85,9.45
  Top 0.381: U7.2 23.62,33.11 C18.1
  Bottom 0.152: v21.39,17.3 21.39,17.25 v19.43,15.29 18.85,15.29 v17.37,13.82 | v12.78,12.22 12.78,10.46 v13.23,10.01
+5V
  Top 0.508: U2.3 13.13,20.3 14.35,21.51 14.35,22.74 U2.5 14.68,23.08 16.2,23.08 C19.2 17.42,24.24 17.42,31.43 22.62,36.63 35.94,36.63 37.21,35.36 | U7.3 32.95,34.06 C16.1 33.22,34.02 35.88,34.02 37.21,35.36 | R21.2 36.58,46.09 36.58,42.98 35.66,42.06 34.79,42.06 L1.P$2 34.79,41.2 C17.+ 37.21,35.36
+24V  (via drill 0.35)
  Top 0.152: CN1.GC 15.89,26.59 15.89,31.53 17.12,32.77 v17.12,33.73 | R23.1 13.89,44.53 13.49,44.12 v12.52,44.12
  Top 0.508: U6.6 20.95,44.2 19.61,44.2 C14.+ 17.6,46.2 14.45,46.2 R23.1 F1.1
  Bottom 0.152: v12.52,44.12 18.21,38.43 18.21,35.69 17.12,34.59 v17.12,33.73
CANH
  Top 0.508: CN1.1 9.25,28.97 11.86,26.35 U2.7
CANL
  Top 0.508: CN1.2 13.13,26.84 U2.6
CANRX
  Top 0.305: U2.4 14.06,17.76 U1.45
CANTX
  Top 0.305: U1.46 13.52,15.93 13.52,16.71 13.34,16.89 11.16,16.89 10.59,17.46 U2.1
GND
  pour Bottom: 45.95,49.99 45.95,2.21 46.76,1.4 79.96,1.4 80.04,1.32 80.04,49.78 79.98,49.83 79.83,49.99
  pour Top: 45.95,50.04 45.95,2.21 46.84,1.32 79.98,1.32 80.04,1.27 80.04,49.07 79.96,49.15 56.18,49.15 54.46,47.42 53.8,47.42 53.77,47.4 53.77,49.91 53.75,49.94 46.05,49.94
GNDIO
  pour Top: 0,50.01 0,0 45.52,0 45.52,49.99 45.49,50.01
  pour Bottom: -0.25,50.04 -0.25,-0.2 -0.2,-0.25 45.24,-0.25 45.24,50.16 45.16,50.24 -0.05,50.24
LED0  (via drill 0.35)
  Top 0.152: v26.93,4.25 26.55,4.63 16.59,4.63 15.07,6.16 U1.18
  Bottom 0.152: R13.1 29.11,4.25 v26.93,4.25
LED1  (via drill 0.35)
  Top 0.152: U1.19 15.57,6.17 16.77,4.96 29.89,4.96 v30.17,5.24
  Bottom 0.152: R14.1 32.08,5.52 30.45,5.52 v30.17,5.24
LED2  (via drill 0.35)
  Top 0.152: U1.20 16.07,6.1 16.9,5.27 29.34,5.27 29.92,5.85 32.65,5.85 v32.66,5.83
  Bottom 0.152: R15.1 36.83,4.41 35.61,5.62 32.87,5.62 v32.66,5.83
LED_CAN  (via drill 0.35)
  Top 0.152: U1.32 19.6,12.34 18.6,12.34 18.3,12.05 18.3,8.8 20.95,6.15 20.95,5.94 v21.01,5.89 | CN1.YC 13.79,36.03 13.79,21.81 13.48,21.5 7.23,21.5 6.73,21.01 v6.73,20.75 | v6.73,13.39 6.73,9.81 10.44,6.1 10.44,2.08 11.46,1.07 15.11,1.07 v16.66,2.62
  Bottom 0.152: v6.73,13.39 v6.73,20.75 | v21.01,5.89 19.96,5.89 16.69,2.62 v16.66,2.62
N$1  (via drill 0.35)
  Top 0.152: RLY-1.7 RLY-1.6
  Top 0.406: v60.35,11.1 53.1,11.1 RLY-1.6
  Bottom 0.406: X1.1 63.76,8.29 D2.A 63.1,11.1 v60.35,11.1
N$2
  Top 0.152: RLY-1.2 43.34,14.07 40.95,11.68 R2.2
N$3
  Bottom 0.152: RLY-0.7 RLY-0.6 52.19,14.21 56.19,10.21
  Bottom 0.406: 56.19,10.21 D1.A 56.19,7.56 X0.1
N$4
  Top 0.152: R2.1 39.24,9.87 37.19,7.81 34.28,7.81 33.73,8.36 IC1.6
N$5  (via drill 0.35)
  Top 0.152: RLY-2.6 RLY-2.7
  Top 0.406: v55.65,19.25 52.63,22.28 RLY-2.6
  Bottom 0.406: X2.1 72.7,11.69 D3.A 67.03,14.05 60.85,14.05 v55.65,19.25
N$6
  Bottom 0.152: RLY-0.2 41.29,9.89 R3.2
N$7  (via drill 0.35)
  Top 0.152: IC1.3 30.12,10.52 v30.12,8.79
  Bottom 0.152: v30.12,8.79 30.79,8.13 35.41,8.13 39.59,3.95 R3.1
N$8
  Top 0.152: RLY-2.2 41.05,22.62 R6.2
N$9  (via drill 0.35)
  Top 0.152: D10.A 31.67,3.95 v31.67,4.87
  Bottom 0.152: R14.2 31.98,3.92 31.98,4.56 v31.67,4.87
N$10  (via drill 0.35)
  Top 0.152: D9.A 27.99,3.74 27.32,3.08 v27.32,3.06
  Bottom 0.152: R13.2 29.11,2.7 27.83,2.7 27.48,3.06 v27.32,3.06
N$11  (via drill 0.35)
  Top 0.152: v4.21,11.35 2.89,11.35 2.85,11.3 Q10.2 2.52,16.2 2.97,16.66 4.95,16.66 9.66,11.95 10.89,11.95 U1.6
  Bottom 0.152: C2.2 4.3,11.35 v4.21,11.35
N$12
  Top 0.508: CN1.4 8.96,33.05 CN1.5
  Top 0.61: F1.2 11.43,42.7 11.43,33.47 CN1.4
N$13
  Top 0.508: U6.7 13.99,42.9 R23.2
  Top 0.61: U6.7 U6.8 U6.1
N$14
  Top 0.508: L1.P$1 30.74,42.9 29.46,42.9 | D8.C 28.65,39.32 28.65,42.08 29.46,42.9 | U6.2 29.46,42.9
N$15
  Top 0.508: U6.3 28.38,44.17 C15.1
N$16
  Top 0.152: SW1.P$1 22.67,2.52 R17.1
N$17
  Top 0.508: U6.5 22.76,47.23 31.32,47.23 R22.2 33.96,46.72 R21.1
N$18
  Top 0.152: R20.2 17.91,39.86 15.11,39.89 CN1.YA
N$19  (via drill 0.35)
  Top 0.152: U1.5 9.89,12.33 5.16,17.07 2.95,17.07 2.54,17.48 2.54,19.23 2.52,19.25 Q10.1 v4.19,21.29
  Bottom 0.152: C1.1 5.28,20.7 4.7,21.29 v4.19,21.29
N$20
  Top 0.152: R6.1 39.5,16.32 35.55,16.32 IC1.8
N$21  (via drill 0.35)
  Top 0.152: v35.03,4.18 33.91,4.18 D11.A
  Bottom 0.152: R15.2 36.83,2.45 35.1,4.18 v35.03,4.18
N$22
  Top 0.254: R19.2 14.79,32.94 CN1.GA
N$23
  Bottom 0.152: 52.57,22.28 RLY-3.7 RLY-3.6
  Bottom 0.406: X3.1 72.12,18.85 D4.A 64.98,22.28 52.57,22.28
N$24
  Bottom 0.152: R8.2 40.44,19.12 43.39,22.07 RLY-3.2
N$25  (via drill 0.35)
  Top 0.152: v31.15,18.43 31.18,18.41 31.18,16.88 IC1.11
  Bottom 0.152: R8.1 40.39,15.56 37.97,13.14 32.59,13.14 31.15,14.58 v31.15,18.43
N$26  (via drill 0.35)
  Top 0.152: RLY-4.7 RLY-4.6
  Top 0.406: v56.64,31.42 55.19,32.87 RLY-4.6
  Bottom 0.406: X4.1 71.61,26.34 D5.A 68.48,26.44 63.5,31.42 v56.64,31.42
N$27
  Top 0.152: RLY-4.2 40.92,33.04 R10.2
N$28
  Top 0.152: R10.1 40.45,30.09 36.22,25.86 36.22,22.35 34.98,21.11 31.11,21.11 30.15,22.07 30.15,23.14 IC2.3
N$29
  Bottom 0.152: RLY-5.6 RLY-5.7
  Bottom 0.406: X5.1 70.93,33.46 D6.A 54.06,33.46 RLY-5.6
N$30
  Bottom 0.152: RLY-5.2 43.06,32.48 41.12,30.54 R12.2
N$31  (via drill 0.35)
  Top 0.152: IC2.6 33.83,24.79 35.92,26.88 35.92,27.59 38.25,29.92 v38.25,30.04
  Bottom 0.152: v38.25,30.04 39.42,30.04 39.98,29.48 39.98,27.62 R12.1
N$32  (via drill 0.35)
  Top 0.152: RLY-6.7 RLY-6.6 52.8,43.1
  Top 0.406: v60.81,36.52 59.77,37.57 58.16,37.57 52.8,42.93 52.8,43.1
  Bottom 0.406: v60.81,36.52 61.04,36.75 64.87,36.75 D7.A 67.25,42.08 X6.1
N$33
  Top 0.152: R25.2 40.86,44.91 42.33,44.91 RLY-6.2
N$34
  Top 0.152: IC2.8 35.1,29.62 35.03,29.69 35.03,31.37 38.31,34.65 38.31,44.06 R25.1
N$35
  Bottom 0.152: RLY-7.6 RLY-7.7
  Bottom 0.406: X7.1 59.48,42.22 59.48,39.09 D12.A 59.89,38.63 57.84,36.58 55.58,36.58 54.13,38.02 54.13,41.29 52.19,43.23 RLY-7.7
N$36
  Bottom 0.152: R27.2 41.21,45.23 RLY-7.2
N$37  (via drill 0.35)
  Top 0.152: IC2.11 31.29,28.73 30.4,27.84 29.84,27.84 29.82,27.81 29.41,28.22 29.41,30.73 31.27,32.59 v34.29,32.59
  Bottom 0.152: R27.1 39.51,44.63 35,40.12 35,33.68 34.29,32.97 v34.29,32.59
N$38
  Bottom 0.152: CN1.6 11.53,32.52 11.53,27.17 14.27,24.43 19.2,24.43 | R4.1 19.1,32.3 19.1,24.53 19.2,24.43 | R18.2 19.83,24.43 19.2,24.43
SOLV1  (via drill 0.35)
  Top 0.152: U1.29 21.24,10.83 22.56,12.15 27.73,12.15 28.65,11.23 IC1.2 28.55,10.82 v28.55,12.29
  Bottom 0.152: v28.55,12.29 30.19,10.65 R1.1
SOLV2  (via drill 0.35)
  Top 0.152: v32.98,8.81 32.98,10.2 IC1.5 32.46,12.8 31.95,13.31 22.59,13.31 20.61,11.33 U1.30
  Bottom 0.152: R5.1 36.45,9.71 33.81,9.71 32.98,8.89 v32.98,8.81
SOLV3  (via drill 0.35)
  Top 0.152: U1.31 20.61,11.83 22.71,13.94 31.7,13.94 32.49,14.73 32.49,16.84 IC1.10 32.46,18.14 32.33,18.26 v32.33,18.44
  Bottom 0.152: v32.33,18.44 33.2,17.58 33.2,17.42 34.7,15.92 R7.1
SOLV4  (via drill 0.35)
  Top 0.152: v29.62,19.39 28.65,18.43 IC1.13 28.65,15.39 28.12,14.86 22.74,14.86 20.71,12.83 U1.33
  Bottom 0.152: R9.1 37.36,14.77 32.74,19.39 30,19.39 v29.62,19.39
SOLV5  (via drill 0.35)
  Top 0.152: v11.25,6.71 10.54,7.42 10.54,8.36 U1.12 | v29.29,24.59 29.21,24.59 28.75,24.13 IC2.2 28.75,22.06 v29.41,21.4
  Bottom 0.152: v11.25,6.71 11.46,6.5 22.38,6.5 23.75,7.87 23.75,20.73 27.61,24.59 v29.29,24.59 | R11.1 38.96,23.69 36.37,21.09 29.72,21.09 v29.41,21.4
SOLV6  (via drill 0.35)
  Top 0.152: v27.84,25.76 28.12,26.04 30.88,26.04 32.56,24.35 IC2.5 32.56,22.43 v33.25,21.74 | U1.13 12.57,7.41 12.09,7.88 v11.56,7.88
  Bottom 0.152: v11.56,7.88 11.64,7.8 11.67,7.8 12.35,7.12 21.97,7.12 23.1,8.24 23.1,20.66 27.84,25.4 v27.84,25.76 | v33.25,21.74 35.31,21.74 35.94,22.38 35.94,26.43 R24.1
SOLV7  (via drill 0.35)
  Top 0.152: v27.1,27.86 27.1,27.71 27.43,27.38 31.59,27.38 32.56,28.35 IC2.10 32.56,30.66 v32.28,30.94 | v12.06,5.33 12.96,5.33 13.57,5.95 U1.15
  Bottom 0.152: v27.1,27.86 27.07,27.84 26.87,27.84 9.98,10.95 9.98,6.7 11.35,5.33 v12.06,5.33 | R26.1 32.54,34.23 31.62,33.31 31.62,31.6 v32.28,30.94
SOLV8  (via drill 0.35)
  Top 0.152: v22.86,26.26 22.86,25.5 21.82,24.46 21.82,20.83 21.11,20.12 17.95,20.12 16.06,18.23 U1.41 | v28.57,32.75 28.75,32.58 IC2.13 28.75,29.13 28.88,29 v28.88,27.96
  Bottom 0.152: v22.86,26.26 22.86,29.16 23.06,29.36 26.92,29.36 28.32,27.96 v28.88,27.96 | R28.1 29.23,33.62 29.16,33.62 28.57,33.03 v28.57,32.75
SWCLK
  Top 0.305: CN3.4 18.52,19.46 18.07,19 U1.37
SWDIO
  Top 0.305: CN3.2 19,18.19 19,16.99 20.71,15.29 20.71,13.56 20.48,13.33 U1.34
UART_RX
  Top 0.305: U1.43 15.09,15.9 15.09,18.68 18.4,22 CN3.8
UART_TX
  Top 0.305: CN3.6 17.81,20.73 15.59,18.51 15.59,15.91 U1.42
VCC  (via drill 0.35)
  Top 0.406: v61.69,7.59 62.23,7.06 62.24,2.76 61.14,1.65 | 61.14,1.65 68.22,1.65 69.06,2.49 69.06,5.18 | 69.06,5.18 73.18,9.3 76.81,9.3 78.49,10.97 78.49,15.29 | 78.49,15.29 78.49,23.52 | 78.49,23.52 78.49,31.65 | 78.49,31.65 78.49,39.83 77.67,40.64 73.2,40.64 | 73.2,40.64 69.62,44.22 69.62,47.19 68.73,48.08 63.45,48.08 | 63.45,48.08 55.63,48.08 54.81,47.27 54.81,44.3 v54.76,44.25 | 73.2,40.64 73.18,40.64 72.11,39.57 70.64,39.57 v70.18,40.03 | 69.06,5.18 v69.06,6.91 | v74.83,16.41 77.37,16.41 78.49,15.29 | v75.87,24.23 77.78,24.23 78.49,23.52 | 78.49,31.65 77.65,32.49 v70.97,32.49 65.37,32.49 REG1.1 | v62.43,45.14 62.43,47.07 63.45,48.08 | 61.14,1.65 50.86,1.65 49.41,3.1 24V.2
  Bottom 0.406: v61.69,7.59 59.99,9.3 D1.C 59.99,7.61 X0.2 | v69.06,6.91 69.06,8.94 D2.C 67.56,7.13 X1.2 | v74.83,16.41 70.31,16.41 D3.C 70.37,14.51 73.03,14.51 X2.2 | v75.87,24.23 69.98,24.23 D4.C 72.73,22.65 X3.2 | v62.43,45.14 62.43,40.16 D7.C 63.45,41.43 64.27,42.24 X6.2 | v54.76,44.25 55.1,43.91 55.1,40.01 56.14,38.96 D12.C 56.71,39.21 56.71,42.06 X7.2 | v70.18,40.03 69.52,39.37 69.52,39.19 69.47,39.14 D6.C 69.7,37.48 72.46,37.48 X5.2 | X4.2 72.91,30.14 D5.C 70.82,32.49 v70.97,32.49
VCC/2  (via drill 0.35)
  Top 0.152: REG1.2 59.65,33.66 58.27,33.66 57.56,32.94 57.56,29.21 55.91,27.57 53.37,27.57 v52.12,28.81 52.32,28.61 RLY-2.8 51.94,27.36 50.01,25.43 v50.01,23.98 | RLY-6.8 51.66,48.51 49.81,46.66 v49.81,44.12 | RLY-4.8 52.27,37.95 52.27,37.54 | 52.27,37.54 51.87,37.54 v51.87,39.19 | v50.01,32.84 50.01,35.61 51.05,36.65 52.27,36.65 52.27,37.54 | v49.73,12.29 49.73,14.78 51.82,16.87 RLY-1.8 52.53,16.97 v52.53,18.21
  Bottom 0.152: v49.81,44.12 49.81,40.79 RLY-7.8 52.19,39.52 v51.87,39.19 | v50.01,32.84 50.01,30.94 50.03,30.94 50.67,30.3 RLY-5.8 52.14,28.83 v52.12,28.81 | v50.01,23.98 50.01,20.75 51.03,19.74 RLY-3.8 52.53,19.68 v52.53,18.21 | RLY-0.8 50.72,10.64 50.72,11.3 v49.73,12.29